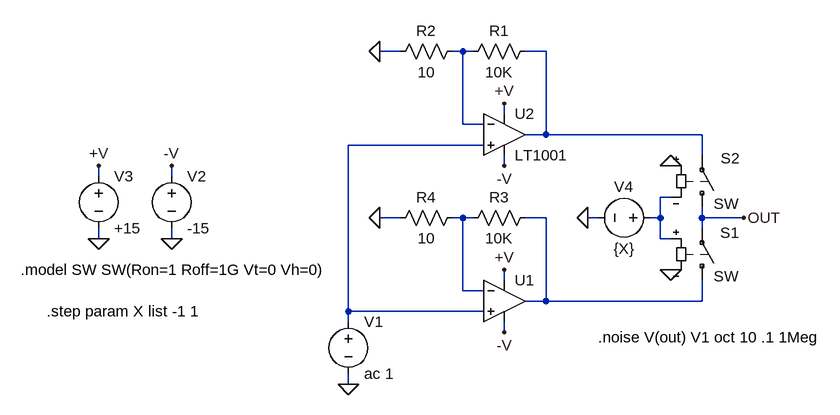
[diagram p0: schematic BoyleNoise1001.asc]
BoyleNoise1001.asc, the LTspice schematic file:
Version 4
SHEET 1 1136 680
WIRE 192 -64 160 -64
WIRE 288 -64 272 -64
WIRE 304 -64 288 -64
WIRE 416 -64 384 -64
WIRE 352 32 352 16
WIRE 288 48 288 -64
WIRE 320 48 288 48
WIRE 416 64 416 -64
WIRE 416 64 384 64
WIRE 656 64 416 64
WIRE 320 80 112 80
WIRE 656 96 656 64
WIRE 352 112 352 96
WIRE -272 128 -272 112
WIRE -160 128 -160 112
WIRE 608 160 592 160
WIRE 192 192 160 192
WIRE 288 192 272 192
WIRE 304 192 288 192
WIRE 416 192 384 192
WIRE 496 192 480 192
WIRE 592 192 592 160
WIRE 592 192 576 192
WIRE 656 192 656 176
WIRE 720 192 656 192
WIRE 656 208 656 192
WIRE -272 224 -272 208
WIRE -160 224 -160 208
WIRE 592 224 592 192
WIRE 608 224 592 224
WIRE 352 288 352 272
WIRE 288 304 288 192
WIRE 320 304 288 304
WIRE 416 320 416 192
WIRE 416 320 384 320
WIRE 656 320 656 288
WIRE 656 320 416 320
WIRE 112 336 112 80
WIRE 320 336 112 336
WIRE 112 352 112 336
WIRE 352 368 352 352
WIRE 112 448 112 432
FLAG 352 16 +V
FLAG 352 112 -V
FLAG -160 224 0
FLAG -272 224 0
FLAG -272 112 +V
FLAG -160 112 -V
FLAG 112 448 0
FLAG 352 272 +V
FLAG 352 368 -V
FLAG 608 112 0
FLAG 608 272 0
FLAG 480 192 0
FLAG 720 192 OUT
FLAG 160 -64 0
FLAG 160 192 0
SYMBOL voltage 112 336 R0
SYMATTR InstName V1
SYMATTR Value ac 1
SYMBOL voltage -160 112 R0
SYMATTR InstName V2
SYMATTR Value -15
SYMBOL voltage -272 112 R0
SYMATTR InstName V3
SYMATTR Value +15
SYMBOL opamps\\LT1001 352 0 R0
SYMATTR InstName U2
SYMBOL opamps\\UniversalOpamp2 352 320 R0
SYMATTR InstName U1
SYMATTR Value2 Avol=800K GBW=.8Meg Slew=.25Meg
SYMATTR SpiceLine2 en=10n enk=4 in=.1p ink=70 Rin=500Meg
SYMBOL sw 656 192 M180
WINDOW 0 29 92 Left 0
WINDOW 3 18 22 Left 0
SYMATTR InstName S2
SYMBOL sw 656 304 M180
WINDOW 0 28 89 Left 0
WINDOW 3 18 22 Left 0
SYMATTR InstName S1
SYMBOL voltage 592 192 R90
WINDOW 0 -32 56 VBottom 0
WINDOW 3 32 56 VTop 0
SYMATTR InstName V4
SYMATTR Value {X}
SYMBOL res 400 -80 R90
WINDOW 0 0 56 VBottom 0
WINDOW 3 32 56 VTop 0
SYMATTR InstName R1
SYMATTR Value 10K
SYMBOL res 288 -80 R90
WINDOW 0 0 56 VBottom 0
WINDOW 3 32 56 VTop 0
SYMATTR InstName R2
SYMATTR Value 10
SYMBOL res 400 176 R90
WINDOW 0 0 56 VBottom 0
WINDOW 3 32 56 VTop 0
SYMATTR InstName R3
SYMATTR Value 10K
SYMBOL res 288 176 R90
WINDOW 0 0 56 VBottom 0
WINDOW 3 32 56 VTop 0
SYMATTR InstName R4
SYMATTR Value 10
TEXT -392 272 Left 0 !.model SW SW(Ron=1 Roff=1G Vt=0 Vh=0)
TEXT -352 336 Left 0 !.step param X list -1 1
TEXT 496 376 Left 0 !.noise V(out) V1 oct 10 .1 1Meg

The netlist it stands for:
* BoyleNoise1001.asc
V1 N003 0 ac 1
V2 -V 0 -15
V3 +V 0 +15
XU2 N003 N001 +V -V N002 LT1001  ; pins In+ In- V+ V- OUT
XU1 N003 N005 +V -V N006 level.2 Avol=800K GBW=.8Meg Slew=.25Meg ilimit=25m rail=0 Vos=0 phimargin=45 en=10n enk=4 in=.1p ink=70 Rin=500Meg  ; pins IN+ IN- V+ V- OUT
S2 OUT N002 0 N004 SW
S1 N006 OUT N004 0 SW
V4 N004 0 {X}
R1 N002 N001 10K
R2 N001 0 10
R3 N006 N005 10K
R4 N005 0 10
.model SW SW(Ron=1 Roff=1G Vt=0 Vh=0)
.step param X list -1 1
.noise V(out) V1 oct 10 .1 1Meg
.lib LTC.lib
.lib UniversalOpamps2.sub
.backanno
.end